# Altium schematic sheet 3.DO.SchDoc
size A1
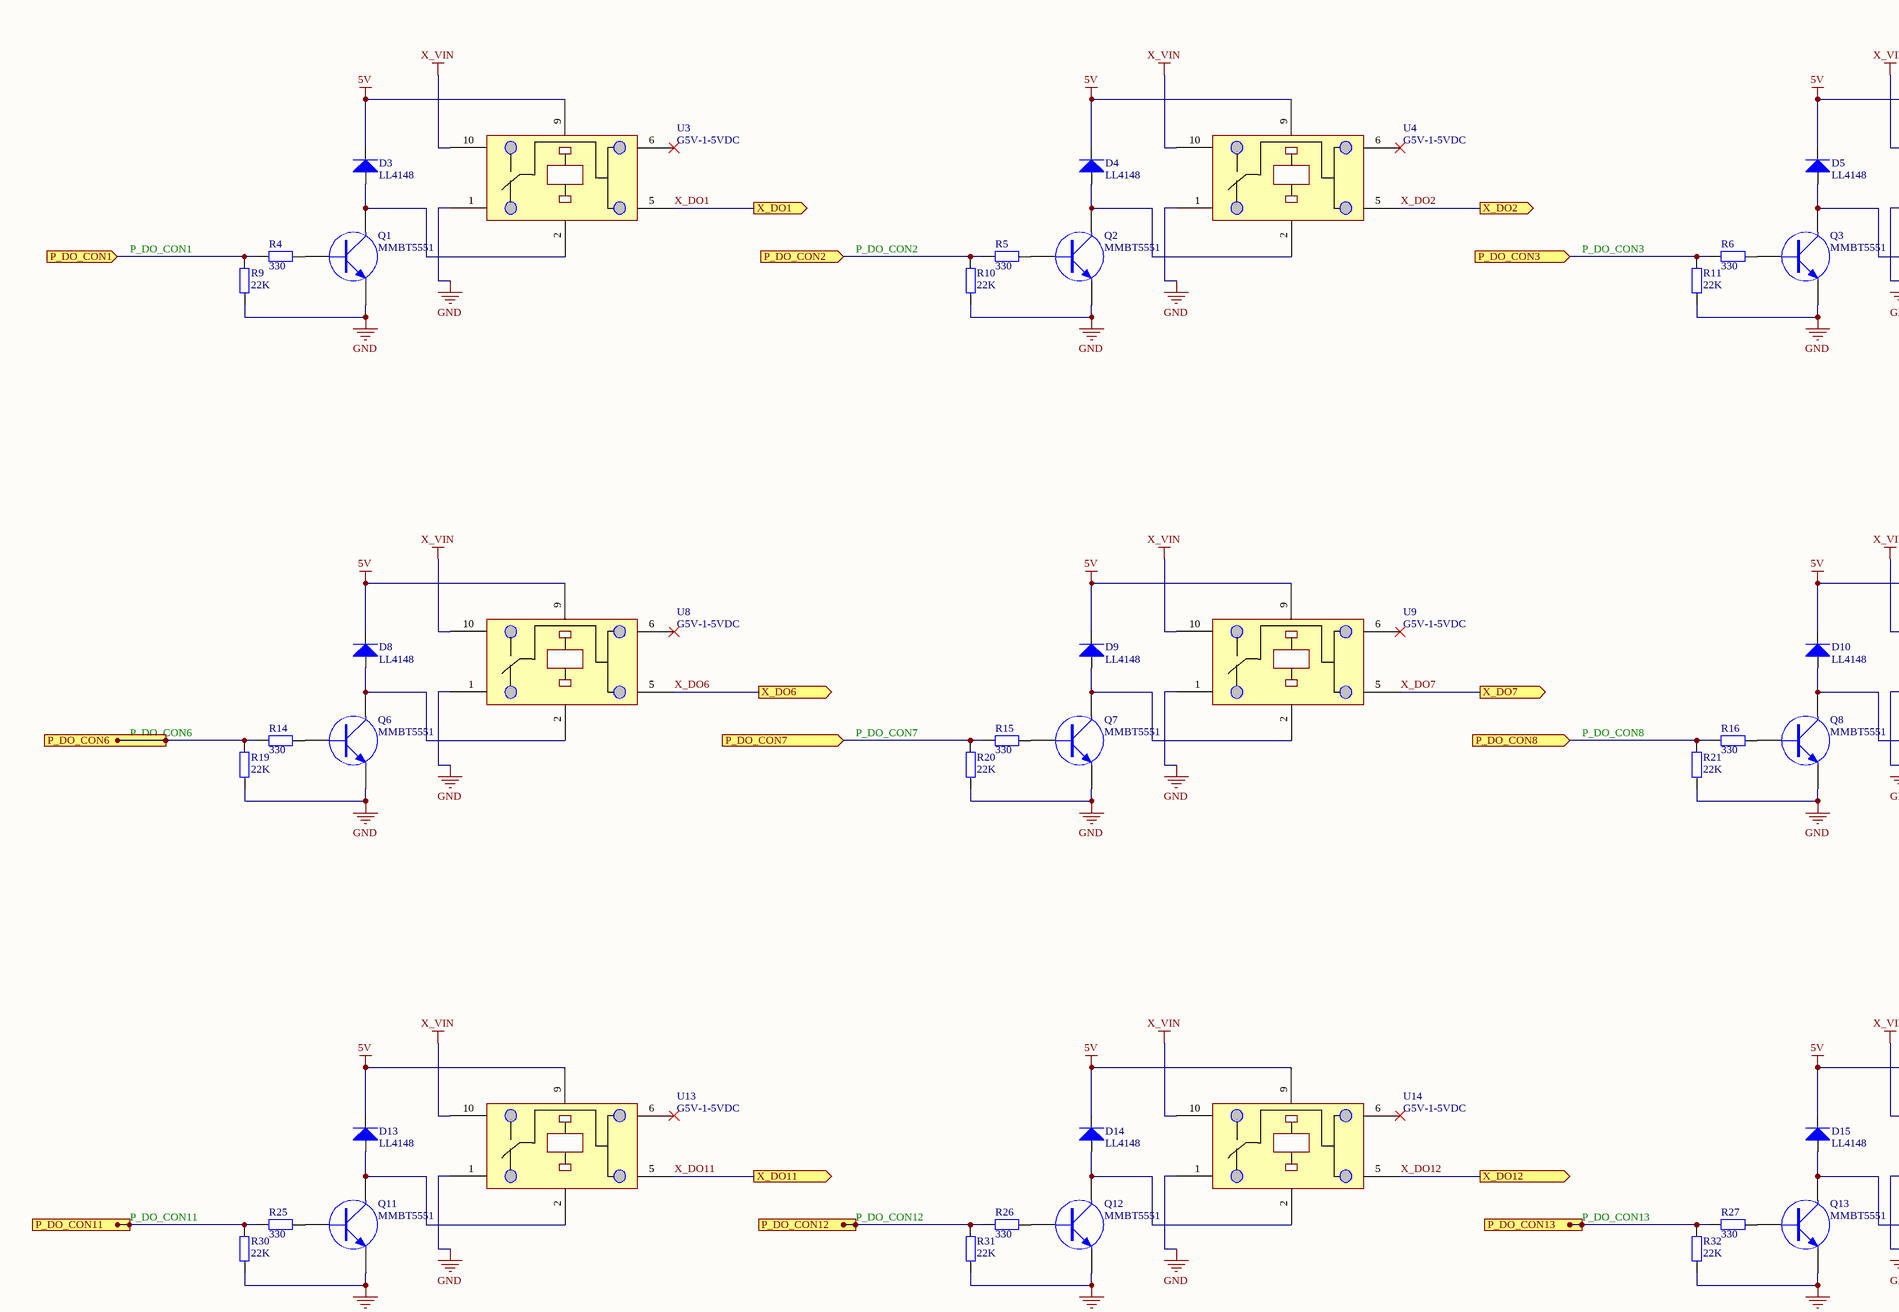
[diagram p0: 3.DO.SchDoc, top left]
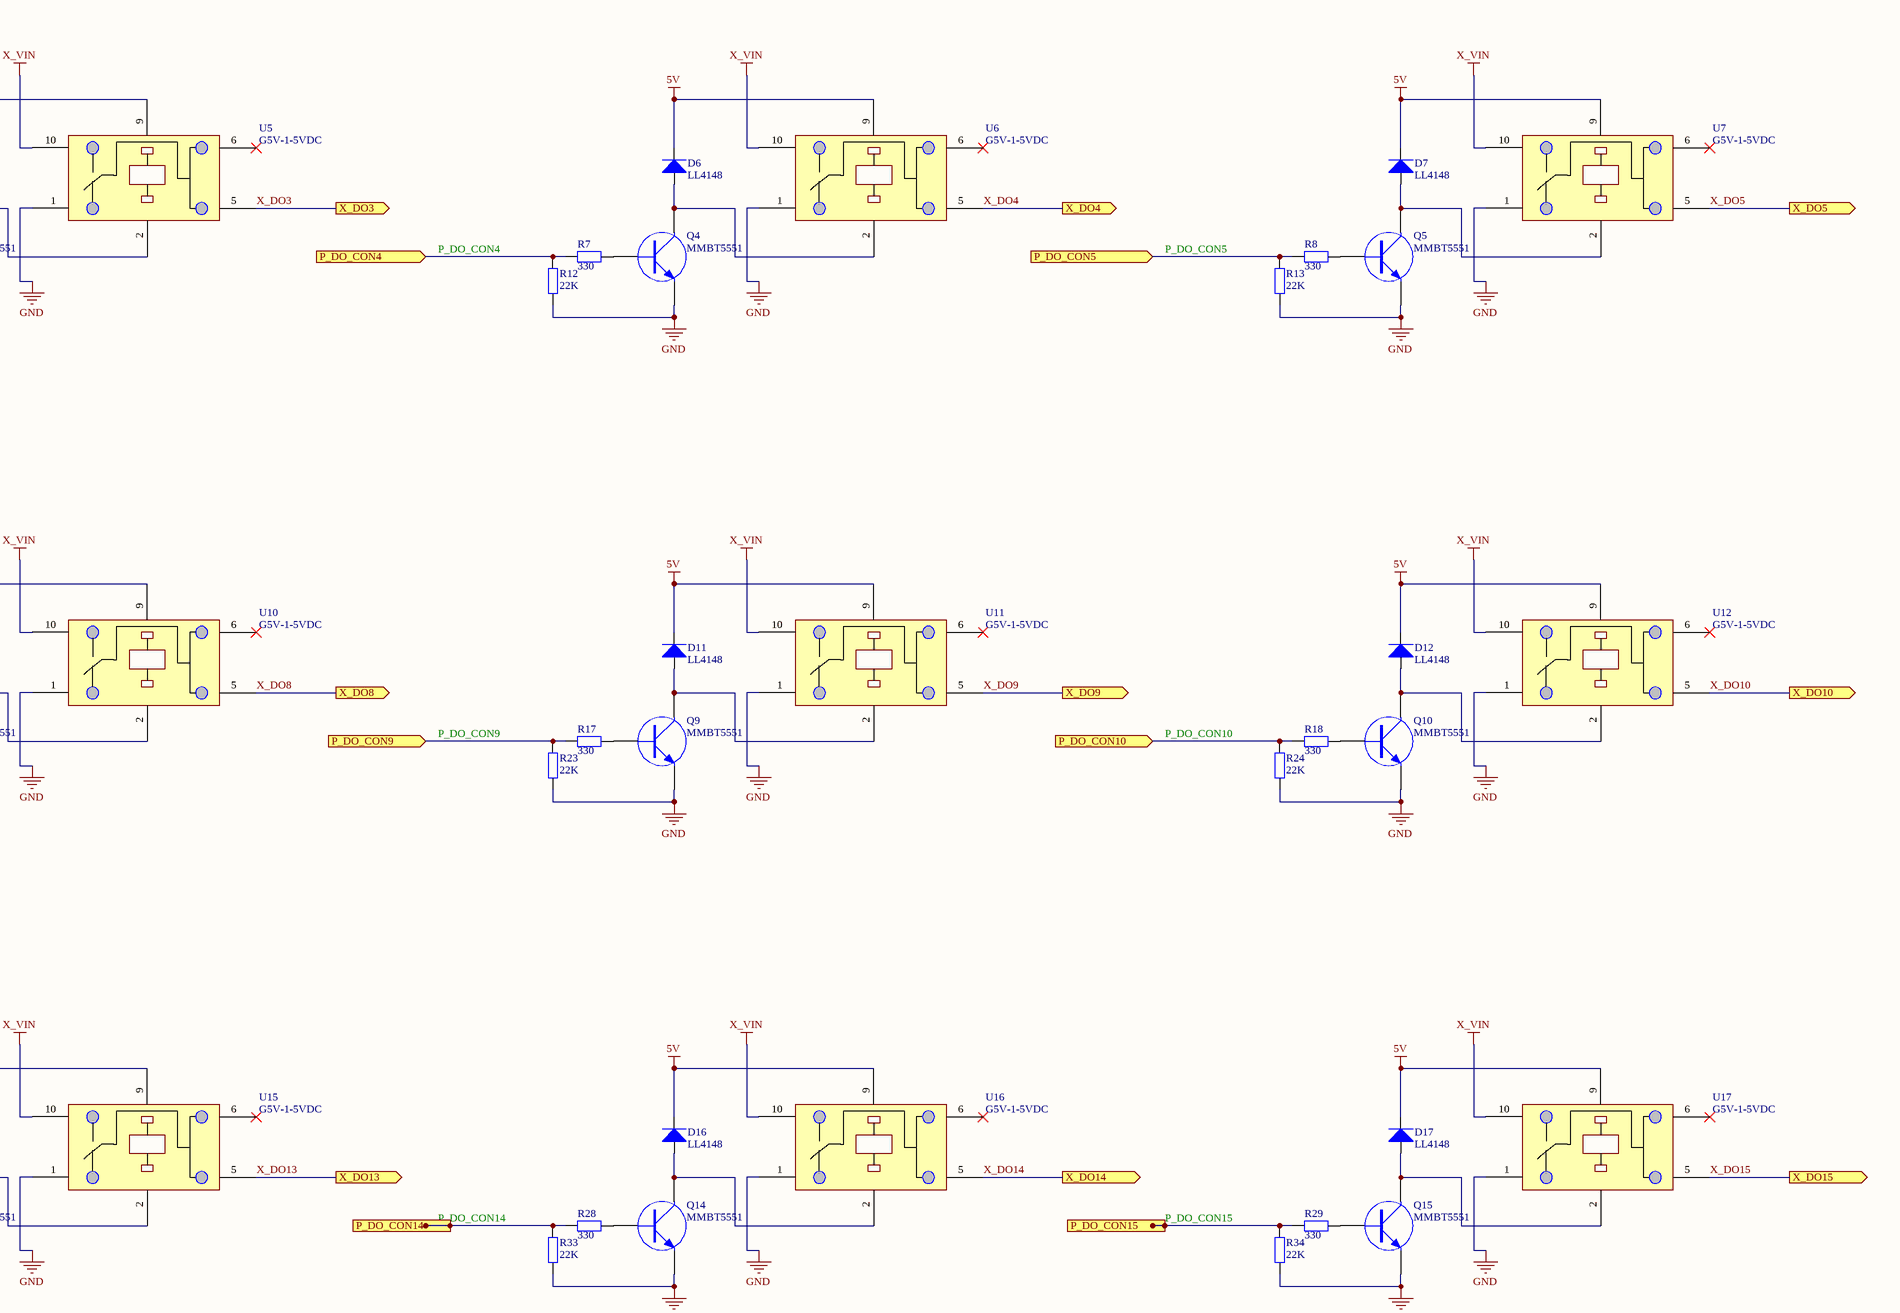
[diagram p1: 3.DO.SchDoc, top right]
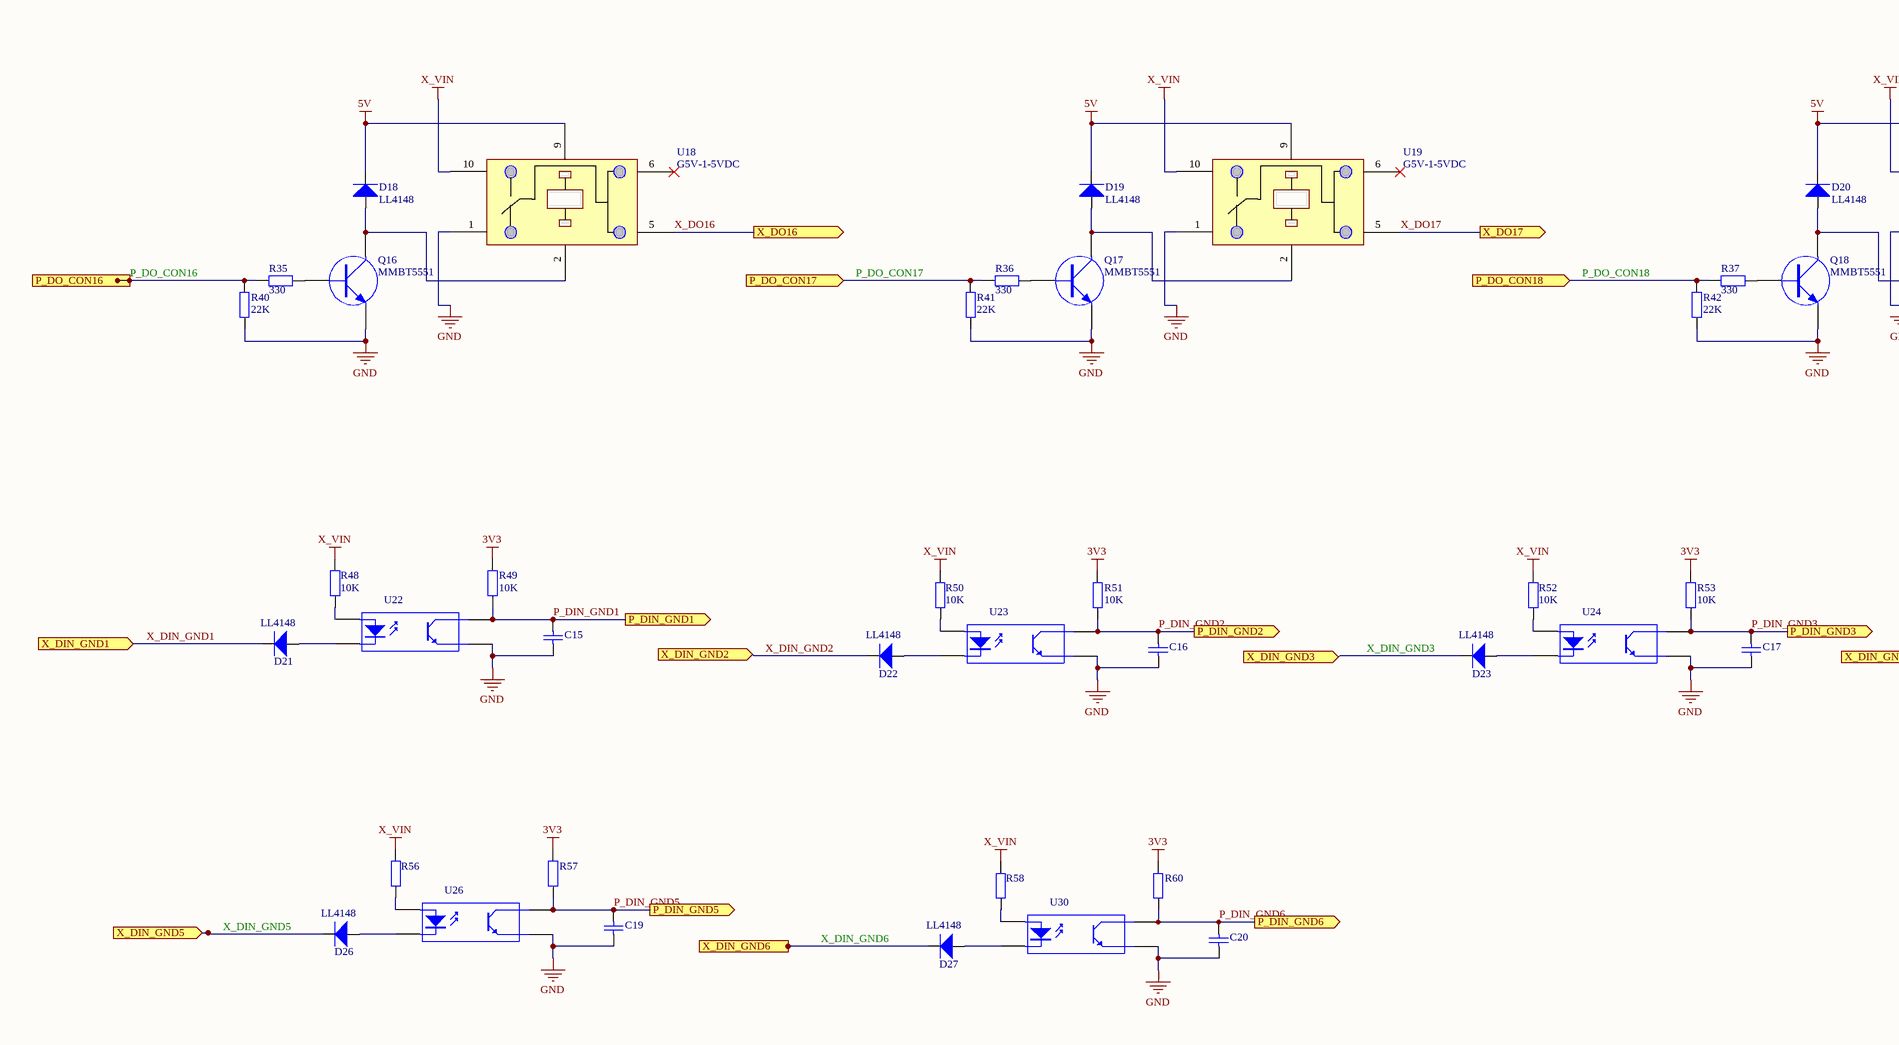
[diagram p2: 3.DO.SchDoc, bottom left]
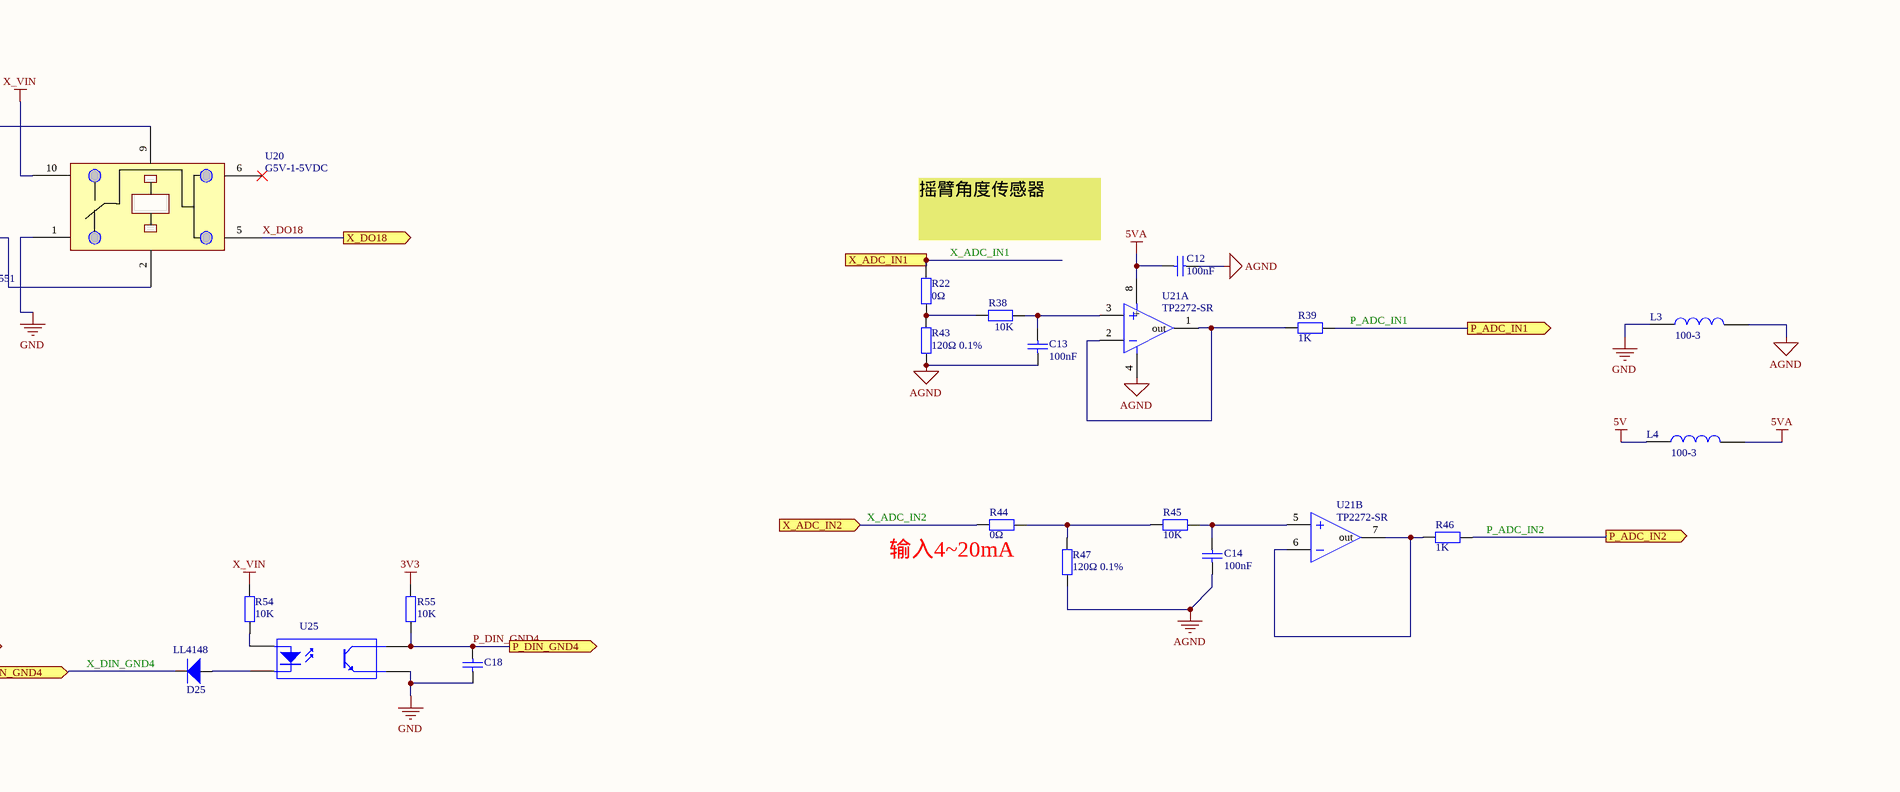
[diagram p3: 3.DO.SchDoc, bottom right]

## Parts
C12  100nF  [C0603-M]
C13  100nF  [C0603-M]
C14  100nF  [C0603-M]
C15  10nF  [C0603-M]  (value not drawn)
C16  10nF  [C0603-M]  (value not drawn)
C17  10nF  [C0603-M]  (value not drawn)
C18  10nF  [C0603-M]  (value not drawn)
C19  10nF  [C0603-M]  (value not drawn)
C20  10nF  [C0603-M]  (value not drawn)
D3  LL4148  [LC-LL-34]
D4  LL4148  [LC-LL-34]
D5  LL4148  [LC-LL-34]
D6  LL4148  [LC-LL-34]
D7  LL4148  [LC-LL-34]
D8  LL4148  [LC-LL-34]
D9  LL4148  [LC-LL-34]
D10  LL4148  [LC-LL-34]
D11  LL4148  [LC-LL-34]
D12  LL4148  [LC-LL-34]
D13  LL4148  [LC-LL-34]
D14  LL4148  [LC-LL-34]
D15  LL4148  [LC-LL-34]
D16  LL4148  [LC-LL-34]
D17  LL4148  [LC-LL-34]
D18  LL4148  [LC-LL-34]
D19  LL4148  [LC-LL-34]
D20  LL4148  [LC-LL-34]
D21  LL4148  [LC-LL-34]
D22  LL4148  [LC-LL-34]
D23  LL4148  [LC-LL-34]
D25  LL4148  [LC-LL-34]
D26  LL4148  [LC-LL-34]
D27  LL4148  [LC-LL-34]
L3  100-3  [L0805-M]
L4  100-3  [L0805-M]
Q1  MMBT5551  [LC-SOT-23(SOT-23-3)]
Q2  MMBT5551  [LC-SOT-23(SOT-23-3)]
Q3  MMBT5551  [LC-SOT-23(SOT-23-3)]
Q4  MMBT5551  [LC-SOT-23(SOT-23-3)]
Q5  MMBT5551  [LC-SOT-23(SOT-23-3)]
Q6  MMBT5551  [LC-SOT-23(SOT-23-3)]
Q7  MMBT5551  [LC-SOT-23(SOT-23-3)]
Q8  MMBT5551  [LC-SOT-23(SOT-23-3)]
Q9  MMBT5551  [LC-SOT-23(SOT-23-3)]
Q10  MMBT5551  [LC-SOT-23(SOT-23-3)]
Q11  MMBT5551  [LC-SOT-23(SOT-23-3)]
Q12  MMBT5551  [LC-SOT-23(SOT-23-3)]
Q13  MMBT5551  [LC-SOT-23(SOT-23-3)]
Q14  MMBT5551  [LC-SOT-23(SOT-23-3)]
Q15  MMBT5551  [LC-SOT-23(SOT-23-3)]
Q16  MMBT5551  [LC-SOT-23(SOT-23-3)]
Q17  MMBT5551  [LC-SOT-23(SOT-23-3)]
Q18  MMBT5551  [LC-SOT-23(SOT-23-3)]
R4  330  [R0603-M]
R5  330  [R0603-M]
R6  330  [R0603-M]
R7  330  [R0603-M]
R8  330  [R0603-M]
R9  22K  [R0603-M]
R10  22K  [R0603-M]
R11  22K  [R0603-M]
R12  22K  [R0603-M]
R13  22K  [R0603-M]
R14  330  [R0603-M]
R15  330  [R0603-M]
R16  330  [R0603-M]
R17  330  [R0603-M]
R18  330  [R0603-M]
R19  22K  [R0603-M]
R20  22K  [R0603-M]
R21  22K  [R0603-M]
R22  0Ω  [R0603-M]
R23  22K  [R0603-M]
R24  22K  [R0603-M]
R25  330  [R0603-M]
R26  330  [R0603-M]
R27  330  [R0603-M]
R28  330  [R0603-M]
R29  330  [R0603-M]
R30  22K  [R0603-M]
R31  22K  [R0603-M]
R32  22K  [R0603-M]
R33  22K  [R0603-M]
R34  22K  [R0603-M]
R35  330  [R0603-M]
R36  330  [R0603-M]
R37  330  [R0603-M]
R38  10K  [R0603-M]
R39  1K  [R0603-M]
R40  22K  [R0603-M]
R41  22K  [R0603-M]
R42  22K  [R0603-M]
R43  120Ω 0.1%  [R0603-M]
R44  0Ω  [R0603-M]
R45  10K  [R0603-M]
R46  1K  [R0603-M]
R47  120Ω 0.1%  [R0603-M]
R48  10K  [R0603-M]
R49  10K  [R0603-M]
R50  10K  [R0603-M]
R51  10K  [R0603-M]
R52  10K  [R0603-M]
R53  10K  [R0603-M]
R54  10K  [R0603-M]
R55  10K  [R0603-M]
R56  10K  [R0603-M]  (value not drawn)
R57  10K  [R0603-M]  (value not drawn)
R58  10K  [R0603-M]  (value not drawn)
R60  10K  [R0603-M]  (value not drawn)
U3  G5V-1-5VDC  [G5V-1]
U4  G5V-1-5VDC  [G5V-1]
U5  G5V-1-5VDC  [G5V-1]
U6  G5V-1-5VDC  [G5V-1]
U7  G5V-1-5VDC  [G5V-1]
U8  G5V-1-5VDC  [G5V-1]
U9  G5V-1-5VDC  [G5V-1]
U10  G5V-1-5VDC  [G5V-1]
U11  G5V-1-5VDC  [G5V-1]
U12  G5V-1-5VDC  [G5V-1]
U13  G5V-1-5VDC  [G5V-1]
U14  G5V-1-5VDC  [G5V-1]
U15  G5V-1-5VDC  [G5V-1]
U16  G5V-1-5VDC  [G5V-1]
U17  G5V-1-5VDC  [G5V-1]
U18  G5V-1-5VDC  [G5V-1]
U19  G5V-1-5VDC  [G5V-1]
U20  G5V-1-5VDC  [G5V-1]
U21  TP2272-SR  [SOIC-127P-8N]  (parts A,B of 2)
U22  EL357N(B)(TA)-G  [LC-SOP-4_P2.54]  (value not drawn)
U23  EL357N(B)(TA)-G  [LC-SOP-4_P2.54]  (value not drawn)
U24  EL357N(B)(TA)-G  [LC-SOP-4_P2.54]  (value not drawn)
U25  EL357N(B)(TA)-G  [LC-SOP-4_P2.54]  (value not drawn)
U26  EL357N(B)(TA)-G  [LC-SOP-4_P2.54]  (value not drawn)
U30  EL357N(B)(TA)-G  [LC-SOP-4_P2.54]  (value not drawn)

## Ports
P_ADC_IN1 (out), P_ADC_IN2 (out), P_DIN_GND1 (out), P_DIN_GND2 (out), P_DIN_GND3 (out), P_DIN_GND4 (out), P_DIN_GND5 (out), P_DIN_GND6 (out), P_DO_CON1 (in), P_DO_CON2 (in), P_DO_CON3 (in), P_DO_CON4 (in), P_DO_CON5 (in), P_DO_CON6 (in), P_DO_CON7 (in), P_DO_CON8 (in), P_DO_CON9 (in), P_DO_CON10 (in), P_DO_CON11 (in), P_DO_CON12 (in), P_DO_CON13 (in), P_DO_CON14 (in), P_DO_CON15 (in), P_DO_CON16 (in), P_DO_CON17 (in), P_DO_CON18 (in), X_ADC_IN1 (in), X_ADC_IN2 (in), X_DIN_GND1 (in), X_DIN_GND2 (in), X_DIN_GND3 (in), X_DIN_GND4 (in), X_DIN_GND5 (in), X_DIN_GND6 (in), X_DO1 (out), X_DO2 (out), X_DO3 (out), X_DO4 (out), X_DO5 (out), X_DO6 (out), X_DO7 (out), X_DO8 (out), X_DO9 (out), X_DO10 (out), X_DO11 (out), X_DO12 (out), X_DO13 (out), X_DO14 (out), X_DO15 (out), X_DO16 (out), X_DO17 (out), X_DO18 (out)

## Nets
3V3: R49.2 R51.2 R53.2 R55.2 R57.2 R60.2
5V: D3.2(K) D4.2(K) D5.2(K) D6.2(K) D7.2(K) D8.2(K) D9.2(K) D10.2(K) D11.2(K) D12.2(K) D13.2(K) D14.2(K) D15.2(K) D16.2(K) D17.2(K) D18.2(K) D19.2(K) D20.2(K) L4.1 U3.9 U4.9 U5.9 U6.9 U7.9 U8.9 U9.9 U10.9 U11.9 U12.9 U13.9 U14.9 U15.9 U16.9 U17.9 U18.9 U19.9 U20.9
5VA: C12.1 L4.2 U21.8(+)
AGND: C12.2 C13.1 C14.1 L3.2 R43.1 R47.2 U21.4(-)
GND: C15.2 C16.2 C17.2 C18.2 C19.2 C20.2 L3.1 Q1.2(E) Q2.2(E) Q3.2(E) Q4.2(E) Q5.2(E) Q6.2(E) Q7.2(E) Q8.2(E) Q9.2(E) Q10.2(E) Q11.2(E) Q12.2(E) Q13.2(E) Q14.2(E) Q15.2(E) Q16.2(E) Q17.2(E) Q18.2(E) R9.1 R10.1 R11.1 R12.1 R13.1 R19.1 R20.1 R21.1 R23.1 R24.1 R30.1 R31.1 R32.1 R33.1 R34.1 R40.1 R41.1 R42.1 U3.1 U4.1 U5.1 U6.1 U7.1 U8.1 U9.1 U10.1 U11.1 U12.1 U13.1 U14.1 U15.1 U16.1 U17.1 U18.1 U19.1 U20.1 U22.3(E) U23.3(E) U24.3(E) U25.3(E) U26.3(E) U30.3(E)
X_VIN: R48.1 R50.1 R52.1 R54.1 R56.1 R58.1 U3.10 U4.10 U5.10 U6.10 U7.10 U8.10 U9.10 U10.10 U11.10 U12.10 U13.10 U14.10 U15.10 U16.10 U17.10 U18.10 U19.10 U20.10
P_ADC_IN1: R39.1 ; port P_ADC_IN1
P_ADC_IN2: R46.1 ; port P_ADC_IN2
P_DIN_GND1: C15.1 R49.1 U22.4(C) ; port P_DIN_GND1
P_DIN_GND2: C16.1 R51.1 U23.4(C) ; port P_DIN_GND2
P_DIN_GND3: C17.1 R53.1 U24.4(C) ; port P_DIN_GND3
P_DIN_GND4: C18.1 R55.1 U25.4(C) ; port P_DIN_GND4
P_DIN_GND5: C19.1 R57.1 U26.4(C) ; port P_DIN_GND5
P_DIN_GND6: C20.1 R60.1 U30.4(C) ; port P_DIN_GND6
P_DO_CON1: R4.2 R9.2 ; port P_DO_CON1
P_DO_CON2: R5.2 R10.2 ; port P_DO_CON2
P_DO_CON3: R6.2 R11.2 ; port P_DO_CON3
P_DO_CON4: R7.2 R12.2 ; port P_DO_CON4
P_DO_CON5: R8.2 R13.2 ; port P_DO_CON5
P_DO_CON6: R14.2 R19.2 ; port P_DO_CON6
P_DO_CON7: R15.2 R20.2 ; port P_DO_CON7
P_DO_CON8: R16.2 R21.2 ; port P_DO_CON8
P_DO_CON9: R17.2 R23.2 ; port P_DO_CON9
P_DO_CON10: R18.2 R24.2 ; port P_DO_CON10
P_DO_CON11: R25.2 R30.2 ; port P_DO_CON11
P_DO_CON12: R26.2 R31.2 ; port P_DO_CON12
P_DO_CON13: R27.2 R32.2 ; port P_DO_CON13
P_DO_CON14: R28.2 R33.2 ; port P_DO_CON14
P_DO_CON15: R29.2 R34.2 ; port P_DO_CON15
P_DO_CON16: R35.2 R40.2 ; port P_DO_CON16
P_DO_CON17: R36.2 R41.2 ; port P_DO_CON17
P_DO_CON18: R37.2 R42.2 ; port P_DO_CON18
X_ADC_IN1: R22.1 ; port X_ADC_IN1
X_ADC_IN2: R44.1 ; port X_ADC_IN2
X_DIN_GND1: D21.2(K) ; port X_DIN_GND1
X_DIN_GND2: D22.2(K) ; port X_DIN_GND2
X_DIN_GND3: D23.2(K) ; port X_DIN_GND3
X_DIN_GND4: D25.2(K) ; port X_DIN_GND4
X_DIN_GND5: D26.2(K) ; port X_DIN_GND5
X_DIN_GND6: D27.2(K) ; port X_DIN_GND6
X_DO1: U3.5 ; port X_DO1
X_DO2: U4.5 ; port X_DO2
X_DO3: U5.5 ; port X_DO3
X_DO4: U6.5 ; port X_DO4
X_DO5: U7.5 ; port X_DO5
X_DO6: U8.5 ; port X_DO6
X_DO7: U9.5 ; port X_DO7
X_DO8: U10.5 ; port X_DO8
X_DO9: U11.5 ; port X_DO9
X_DO10: U12.5 ; port X_DO10
X_DO11: U13.5 ; port X_DO11
X_DO12: U14.5 ; port X_DO12
X_DO13: U15.5 ; port X_DO13
X_DO14: U16.5 ; port X_DO14
X_DO15: U17.5 ; port X_DO15
X_DO16: U18.5 ; port X_DO16
X_DO17: U19.5 ; port X_DO17
X_DO18: U20.5 ; port X_DO18
NetC13_2: C13.2 R38.1 U21.3
NetC14_2: C14.2 R45.1 U21.5
NetD3_1: D3.1(A) Q1.3(C) U3.2
NetD4_1: D4.1(A) Q2.3(C) U4.2
NetD5_1: D5.1(A) Q3.3(C) U5.2
NetD6_1: D6.1(A) Q4.3(C) U6.2
NetD7_1: D7.1(A) Q5.3(C) U7.2
NetD8_1: D8.1(A) Q6.3(C) U8.2
NetD9_1: D9.1(A) Q7.3(C) U9.2
NetD10_1: D10.1(A) Q8.3(C) U10.2
NetD11_1: D11.1(A) Q9.3(C) U11.2
NetD12_1: D12.1(A) Q10.3(C) U12.2
NetD13_1: D13.1(A) Q11.3(C) U13.2
NetD14_1: D14.1(A) Q12.3(C) U14.2
NetD15_1: D15.1(A) Q13.3(C) U15.2
NetD16_1: D16.1(A) Q14.3(C) U16.2
NetD17_1: D17.1(A) Q15.3(C) U17.2
NetD18_1: D18.1(A) Q16.3(C) U18.2
NetD19_1: D19.1(A) Q17.3(C) U19.2
NetD20_1: D20.1(A) Q18.3(C) U20.2
NetD21_1: D21.1(A) U22.2(K)
NetD22_1: D22.1(A) U23.2(K)
NetD23_1: D23.1(A) U24.2(K)
NetD25_1: D25.1(A) U25.2(K)
NetD26_1: D26.1(A) U26.2(K)
NetD27_1: D27.1(A) U30.2(K)
NetQ1_1: Q1.1(B) R4.1
NetQ2_1: Q2.1(B) R5.1
NetQ3_1: Q3.1(B) R6.1
NetQ4_1: Q4.1(B) R7.1
NetQ5_1: Q5.1(B) R8.1
NetQ6_1: Q6.1(B) R14.1
NetQ7_1: Q7.1(B) R15.1
NetQ8_1: Q8.1(B) R16.1
NetQ9_1: Q9.1(B) R17.1
NetQ10_1: Q10.1(B) R18.1
NetQ11_1: Q11.1(B) R25.1
NetQ12_1: Q12.1(B) R26.1
NetQ13_1: Q13.1(B) R27.1
NetQ14_1: Q14.1(B) R28.1
NetQ15_1: Q15.1(B) R29.1
NetQ16_1: Q16.1(B) R35.1
NetQ17_1: Q17.1(B) R36.1
NetQ18_1: Q18.1(B) R37.1
NetR22_2: R22.2 R38.2 R43.2
NetR39_2: R39.2 U21.1(out) U21.2
NetR44_2: R44.2 R45.2 R47.1
NetR46_2: R46.2 U21.6 U21.7(out)
NetR48_2: R48.2 U22.1(A)
NetR50_2: R50.2 U23.1(A)
NetR52_2: R52.2 U24.1(A)
NetR54_2: R54.2 U25.1(A)
NetR56_2: R56.2 U26.1(A)
NetR58_2: R58.2 U30.1(A)

Not connected (* = marked no-connect by the designer): U3 6*; U4 6*; U5 6*; U6 6*; U7 6*; U8 6*; U9 6*; U10 6*; U11 6*; U12 6*; U13 6*; U14 6*; U15 6*; U16 6*; U17 6*; U18 6*; U19 6*; U20 6*

## Notes on the sheet
- (near R22) 摇臂角度传感器
- (near R44) 输入4~20mA

## Library data of the parts
C12 C13 = Cap Semi: 贴片电容/50V100nF/10%; Published: 8-Jun-2000; LatestRevisionDate: 17-Jul-2002; LatestRevisionNote: Re-released for DXP Platform.; PackageReference: C1206; Publisher: Altium Limited; Value: 100nF
C14 = Cap Semi: 贴片电容/50V100nF/10%; Value: 0.1uF; Published: 8-Jun-2000; LatestRevisionDate: 17-Jul-2002; LatestRevisionNote: Re-released for DXP Platform.; PackageReference: C1206; Publisher: Altium Limited
C15-C18 = Cap Semi: 贴片电容; Published: 8-Jun-2000; LatestRevisionDate: 17-Jul-2002; LatestRevisionNote: Re-released for DXP Platform.; PackageReference: C1206; Publisher: Altium Limited; Value: 10nF
C19 C20 = Cap Semi: 贴片电容/50V10nF; Published: 8-Jun-2000; LatestRevisionDate: 17-Jul-2002; LatestRevisionNote: Re-released for DXP Platform.; PackageReference: C1206; Publisher: Altium Limited; Value: 10nF
D3-D23 D25-D27 = DIODE: 二极管LL4148; Value: LL4148
L3 L4 = INDUCTOR: 贴片磁珠/100Ω 3A/0805; Value: GZ2012D101TF
Q1-Q18 = NPN2: 三极管/MMBT5551/NPN; 型号: MMBT5551
R4-R8 R14-R18 R25-R29 R35-R37 = Res2: 贴片电阻/330; Published: 8-Jun-2000; LatestRevisionDate: 17-Jul-2002; LatestRevisionNote: Re-released for DXP Platform.; PackageReference: AXIAL-0.4; Publisher: Altium Limited; Value: 330
R9-R13 R19-R21 R23 R24 R30-R34 R40-R42 = Res2: 贴片电阻; Value: 33K; Published: 8-Jun-2000; LatestRevisionDate: 17-Jul-2002; LatestRevisionNote: Re-released for DXP Platform.; PackageReference: AXIAL-0.4; Publisher: Altium Limited
R22 R44 = RES2: Published: 8-Jun-2000; Revision: July-2002: Re-released for DXP Platform.; Publisher: Altium Limited; Value: 0Ω
R38 R45 = Res2: 贴片电阻/10K1%; Published: 8-Jun-2000; LatestRevisionDate: 17-Jul-2002; LatestRevisionNote: Re-released for DXP Platform.; PackageReference: AXIAL-0.4; Publisher: Altium Limited; Value: 10K
R39 R43 R48-R55 = Res2: 贴片电阻; Published: 8-Jun-2000; LatestRevisionDate: 17-Jul-2002; LatestRevisionNote: Re-released for DXP Platform.; PackageReference: AXIAL-0.4; Publisher: Altium Limited
  R48-R55: Value: 10K
R46 = Res2: 贴片电阻/1K; Value: 2K1%; Published: 8-Jun-2000; LatestRevisionDate: 17-Jul-2002; LatestRevisionNote: Re-released for DXP Platform.; PackageReference: AXIAL-0.4; Publisher: Altium Limited
R47 = Res2: 贴片高精密、低温漂电阻//100Ω0.1%; Published: 8-Jun-2000; LatestRevisionDate: 17-Jul-2002; LatestRevisionNote: Re-released for DXP Platform.; PackageReference: AXIAL-0.4; Publisher: Altium Limited; Value: 100Ω0.1%
R56-R58 R60 = Res2: 贴片电阻/10K; Published: 8-Jun-2000; LatestRevisionDate: 17-Jul-2002; LatestRevisionNote: Re-released for DXP Platform.; PackageReference: AXIAL-0.4; Publisher: Altium Limited; Value: 10K
U3-U20 = G5V-1: 继电器//欧姆龙//G5V-1-5VDC
U21 = LM358: Value: LM2904DR
U22-U26 U30 = TLP521-1: 贴片光耦//EL357N(B)(TA)-G; Value: EL357N(B)(TA)-G